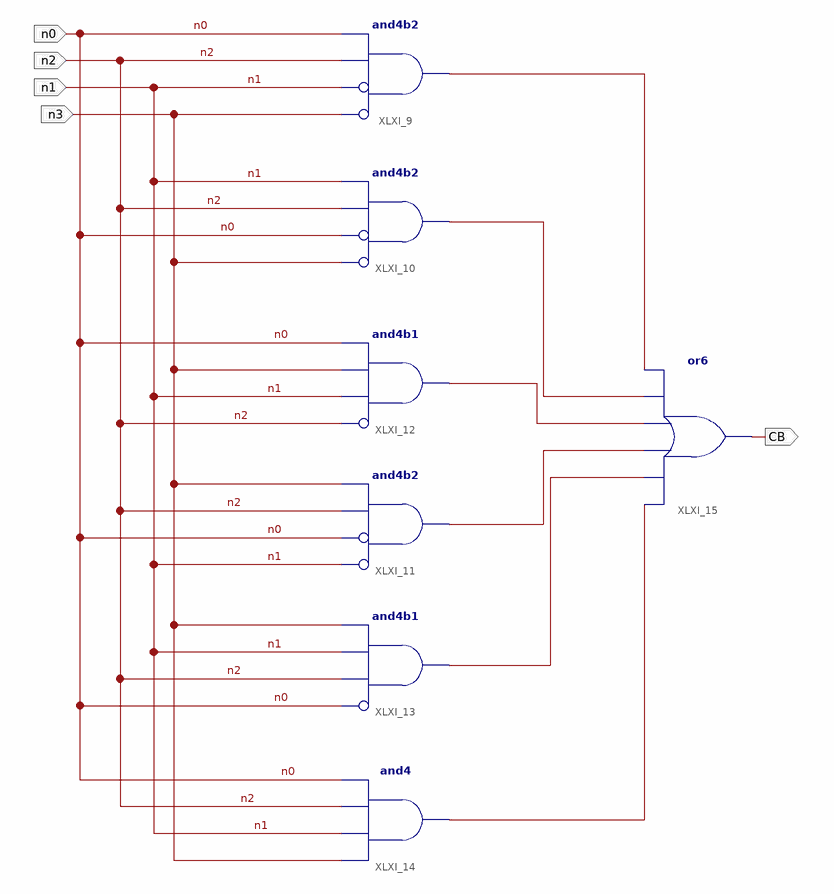
[diagram p0: schematic sheet 1]
// Xilinx ISE schematic B.sch (spartan3e) as structural Verilog: 7 symbols, 5 ports
module B (
  input  n0,
  input  n2,
  input  n1,
  input  n3,
  output CB
);

  wire XLXN_1, XLXN_3, XLXN_4, XLXN_5, XLXN_6, XLXN_7;

  and XLXI_9 (XLXN_1, ~n3, ~n1, n2, n0);  // and4b2
  and XLXI_10 (XLXN_3, ~n3, ~n0, n2, n1);  // and4b2
  and XLXI_11 (XLXN_5, ~n1, ~n0, n2, n3);  // and4b2
  and XLXI_12 (XLXN_4, ~n2, n1, n3, n0);  // and4b1
  and XLXI_13 (XLXN_6, ~n0, n2, n1, n3);  // and4b1
  and XLXI_14 (XLXN_7, n3, n1, n2, n0);
  or XLXI_15 (CB, XLXN_7, XLXN_6, XLXN_5, XLXN_4, XLXN_3, XLXN_1);
endmodule
